# Altium schematic sheet DE-180417_01.SchDoc: Power Board
size A4; Author: eldar6776@hotmail.com; DrawnBy: Eldar Dedić; Organization: I-MEDIA GROUP d.o.o.; Address1: Topal Osman Paše 18; Address2: 71000 Sarajevo; Address3: Federacija BiH; Address4: Bosna i Hercegovina; DocumentNumber: 1; Revision: 001; SheetNumber: 1; SheetTotal: 3; ProjectName: Prekidač rasvjete balkona
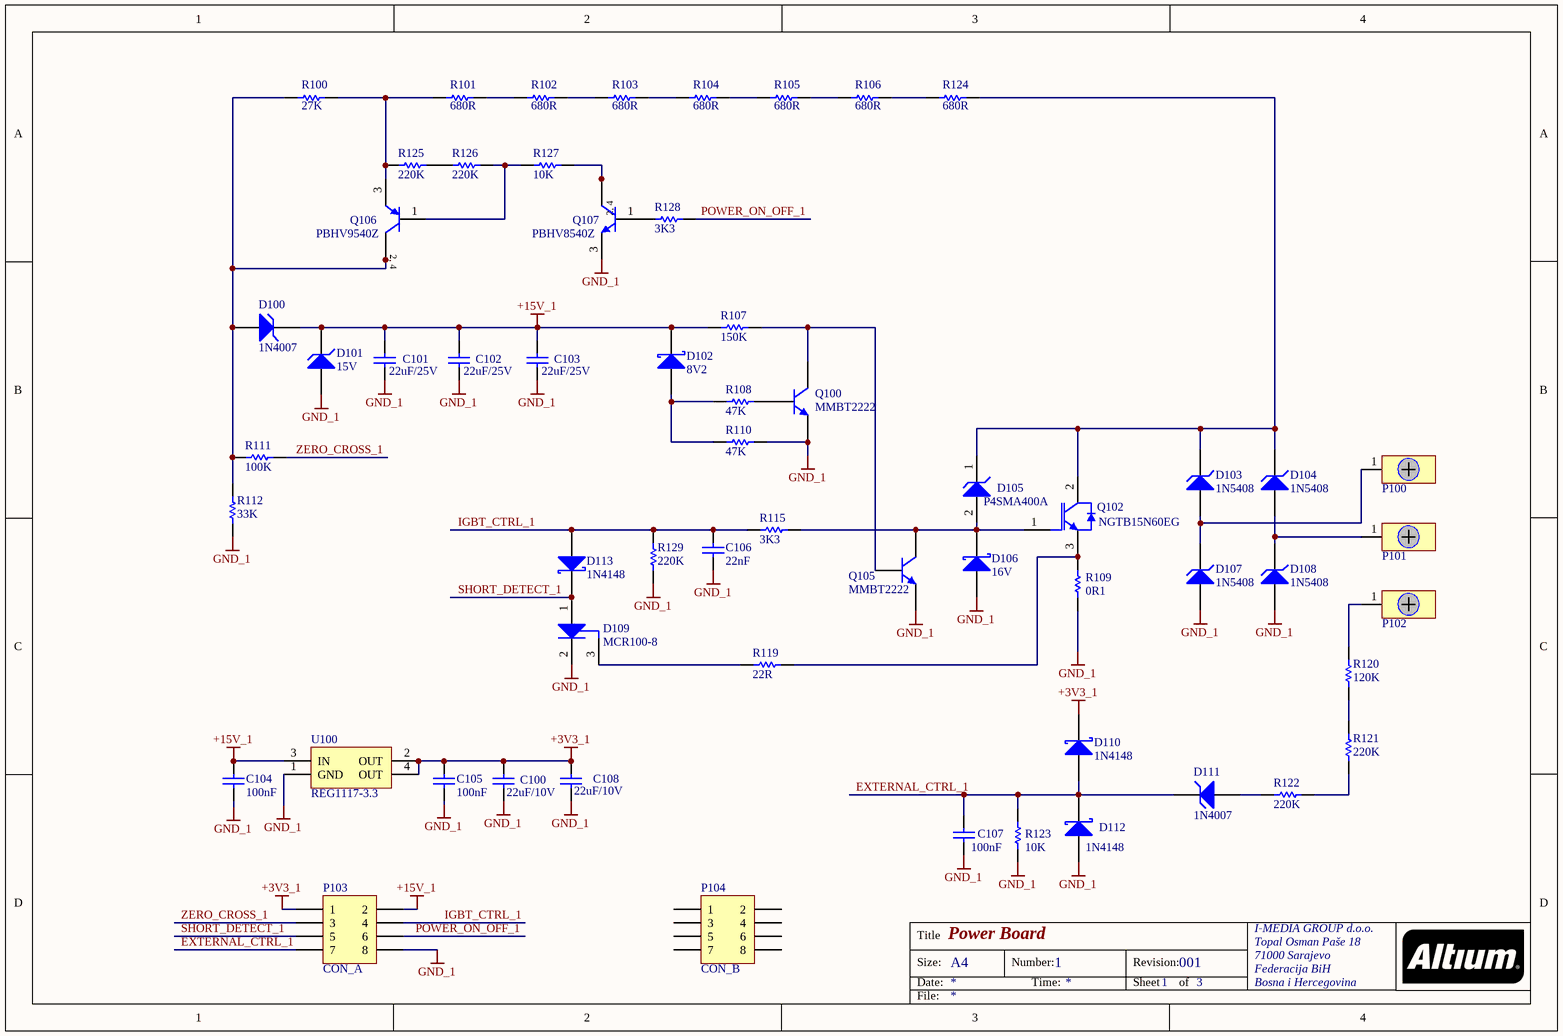
[diagram p0: DE-180417_01.SchDoc]

## Parts
C100  22uF/10V  [1210]
C101  22uF/25V  [1210]
C102  22uF/25V  [1210]
C103  22uF/25V  [1210]
C104  100nF  [0603]
C105  100nF  [0603]
C106  22nF  [0603]
C107  100nF  [0603]
C108  22uF/10V  [1210]
D100  1N4007  [DO214]
D101  15V  [DO214]
D102  8V2  [SOD323]
D103  1N5408  [DO214]
D104  1N5408  [DO214]
D105  P4SMA400A  [ONSC-SMC-2-403-03_V]
D106  16V  [SOD323]
D107  1N5408  [DO214]
D108  1N5408  [DO214]
D109  MCR100-8  [INF-SOT89_N]
D110  1N4148  [SOD323]
D111  1N4007  [DO214]
D112  1N4148  [SOD323]
D113  1N4148  [SOD323]
P100  Single Wire Lug  [Single Wire Lug]  (value not drawn)
P101  Single Wire Lug  [Single Wire Lug]  (value not drawn)
P102  Single Wire Lug  [Single Wire Lug]  (value not drawn)
P103  CON_A  [HDR2X4]
P104  CON_B  [HDR2X4]
Q100  MMBT2222  [SOT23_N]
Q102  NGTB15N60EG  [ONSC-TO-220-3-221A-09]
Q105  MMBT2222  [SOT23_N]
Q106  PBHV9540Z  [SOT223_N]
Q107  PBHV8540Z  [SOT223_N]
R100  27K  [12-1812]
R101  680R  [12-1812]
R102  680R  [12-1812]
R103  680R  [12-1812]
R104  680R  [12-1812]
R105  680R  [12-1812]
R106  680R  [12-1812]
R107  150K  [ERA-0603]
R108  47K  [ERA-0603]
R109  0R1  [14-1210]
R110  47K  [ERA-0603]
R111  100K  [ERA-0603]
R112  33K  [ERA-0805]
R115  3K3  [ERA-0603]
R119  22R  [ERA-0603]
R120  120K  [ERA-0805]
R121  220K  [ERA-0805]
R122  220K  [ERA-0805]
R123  10K  [ERA-0603]
R124  680R  [12-1812]
R125  220K  [ERA-0805]
R126  220K  [ERA-0805]
R127  10K  [ERA-0805]
R128  3K3  [ERA-0805]
R129  220K  [ERA-0603]
U100  REG1117-3.3  [ZZ311]

## Nets
+3V3_1: C100.2 C105.2 C108.2 D110.1(K) P103.1 U100.2(OUT) U100.4(OUT)
+15V_1: C101.2 C102.2 C103.2 C104.2 D100.2(K) D101.2(K) D102.1(K) P103.2 R107.1 U100.3(IN)
GND_1: C100.1 C101.1 C102.1 C103.1 C104.1 C105.1 C106.1 C107.1 C108.1 D101.1(A) D106.2(A) D107.1(A) D108.1(A) D109.2(K) D112.2(A) P103.8 Q100.2(E) Q105.2(E) Q107.3(E) R109.1 R110.2 R112.1 R123.1 R129.1 U100.1(GND)
EXTERNAL_CTRL_1: C107.2 D110.2(A) D111.2(K) D112.1(K) P103.7 R123.2
IGBT_CTRL_1: C106.2 D113.2(A) P103.4 R115.1 R129.2
POWER_ON_OFF_1: P103.6 R128.1
SHORT_DETECT_1: D109.1(A) D113.1(K) P103.5
ZERO_CROSS_1: P103.3 R111.1
NetD100_1: D100.1(A) Q106.2(C) Q106.4(C) R100.1 R111.2 R112.2
NetD102_2: D102.2(A) R108.1 R110.1
NetD103_1: D103.1(A) D107.2(K) P100.1
NetD103_2: D103.2(K) D104.2(K) D105.1(K) Q102.2(C) R124.2
NetD104_1: D104.1(A) D108.2(K) P101.1
NetD105_2: D105.2(A) D106.1(K) Q102.1(G) Q105.3(C) R115.2
NetD109_3: D109.3(G) R119.1
NetD111_1: D111.1(A) R122.2
NetP102_1: P102.1 R120.1
NetQ100_1: Q100.1(B) R108.2
NetQ100_3: Q100.3(C) Q105.1(B) R107.2
NetQ102_3: Q102.3(E) R109.2 R119.2
NetQ106_1: Q106.1(B) R126.1 R127.2
NetQ106_3: Q106.3(E) R100.2 R101.1 R125.1
NetQ107_1: Q107.1(B) R128.2
NetQ107_2: Q107.2(C) Q107.4(C) R127.1
NetR101_2: R101.2 R102.1
NetR102_2: R102.2 R103.1
NetR103_2: R103.2 R104.1
NetR104_2: R104.2 R105.1
NetR105_2: R105.2 R106.1
NetR106_2: R106.2 R124.1
NetR120_2: R120.2 R121.1
NetR121_2: R121.2 R122.1
NetR125_2: R125.2 R126.2

Not connected (* = marked no-connect by the designer): P104 1 2 3 4 5 6 7 8

## Notes on the sheet
- Title
- Size:
- Date:
- A4
- Number:
- Time:
- Revision:
- Sheet
- of
- File:
- (in symbol BCP51) 2, 4
- (in symbol BCP54) 2, 4

## Library data of the parts
C100-C103 C108 = C1210: Ceramic Chip Capacitor - Standard; Published: 17-Jul-2002; LatestRevisionDate: 19-Mar-2004; LatestRevisionNote: Silkscreen size reduced.; DatasheetDocument: Mar-2001; PackageDocument: Mar-2001; PackageReference: 1210; Publisher: Altium Limited; Code_JEITA: 1210; Code_IPC: 3225 [1210]; ComponentLink1Description: Manufacturer Link; ComponentLink1URL: http://www.kemet.com/; ComponentLink2Description: Datasheet; ComponentLink2URL: http://www.kemet.com/kemet/web/homepage/kechome.nsf/vapubfilesname/F3102TA.pdf/$file/F3102TA.pdf
  C100 C108: Value: 22uF/10V
  C101-C103: Value: 22uF/25V
C104-C107 = C0603: Ceramic Chip Capacitor - Standard; Note: Footprint corresponds to dimensions for bulk cassette packaging. This case size has tightened tolerances.; Published: 17-Jul-2002; LatestRevisionDate: 19-Mar-2004; LatestRevisionNote: Silkscreen size reduced.; DatasheetDocument: Mar-2001; PackageDocument: Mar-2001; PackageReference: 0603; Publisher: Altium Limited; Code_JEITA: 0603; Code_IPC: 1608 [0603]; ComponentLink1Description: Manufacturer Link; ComponentLink1URL: http://www.kemet.com/; ComponentLink2Description: Datasheet; ComponentLink2URL: http://www.kemet.com/kemet/web/homepage/kechome.nsf/vapubfilesname/F3102TA.pdf/$file/F3102TA.pdf
D100 D111 = BZG03C10: Silicon Zener Diode (3W); Published: 8-Jun-2000; LatestRevisionDate: 17-Jul-2002; LatestRevisionNote: Re-released for DXP Platform.; DatasheetDocument: 1-Apr-1999; PackageDocument: Apr-1999; PackageReference: DO214; Publisher: Altium Limited; ComponentLink1Description: Manufacturer Link; ComponentLink1URL: http://www.vishay.com/; ComponentLink2Description: Datasheet; ComponentLink2URL: http://www.vishay.com/docs/85593/85593.pdf
D101 D103 D104 D107 D108 = BZG05C15: Silicon Zener Diode (3W); Published: 8-Jun-2000; LatestRevisionDate: 17-Jul-2002; LatestRevisionNote: Re-released for DXP Platform.; DatasheetDocument: 1-Apr-1999; PackageDocument: Apr-1999; PackageReference: DO214; Publisher: Altium Limited; ComponentLink1Description: Manufacturer Link; ComponentLink1URL: http://www.vishay.com/; ComponentLink2Description: Datasheet; ComponentLink2URL: http://www.vishay.com/docs/85595/85595.pdf
  D101: Value: 15V
  D103 D104 D107 D108: Value: 1N5408
D102 D106 D110 D112 D113 = 1PS76SB10: Schottky Barrier Diode; Published: 17-Sep-2003; LatestRevisionDate: 19-Mar-2004; LatestRevisionNote: Silkscreen size reduced.; DatasheetVersion: 14-Oct-1996; PackageVersion: May-1999; PackageReference: SOD323; Publisher: Altium Limited; PackageDescription: SOD-323/SC-76; 2 Leads; Body 1.7 x 1.3 mm, (LxW); ComponentLink1Description: Manufacturer Link; ComponentLink1URL: http://www.semiconductors.philips.com/; ComponentLink2Description: Datasheet; ComponentLink2URL: http://www.semiconductors.philips.com/acrobat/datasheets/1PS76SB10_2.pdf
D105 = 1SMC9.0AT3G: 1500 W Peak Power Zener Transient Voltage Suppressor, Unidirectional, 2-Pin SMC, Pb-Free, Tape and Reel; Manufacturer: On Semiconductor; IR Max (uA): 10; PPK Max (W): 1500; V(BR) Typ (V): 10.55; DatasheetVersion: Rev. 8; PackageVersion: Rev. E, 08/2005; PackageReference: SMC-2-403-03; PackageDescription: 2-Pin Small Molded Package, J-Bend Lead, Body 5.845 x 6.855 mm; Supplier 1: Digi-Key; Supplier Part Number 1: 1SMC9.0AT3G-ND; Supplier 2: Mouser; Supplier Part Number 2: 863-1SMC9.0AT3G; Direction: Unidirectional; Packing: Tape and Reel; RoHS: Pb-Free; Mounting Technology: Surface Mount; PartNumber: 1SMC9.0AT3G; ComponentLink1Description: Manufacturer URL; ComponentLink1URL: http://www.onsemi.com/; ComponentLink2Description: Datasheet; ComponentLink2URL: http://www.onsemi.com/pub_link/Collateral/1SMC5.0AT3-D.PDF; ComponentLink3Description: Package Specification; ComponentLink3URL: http://www.onsemi.com/pub_link/Collateral/403-03.PDF
D109 = BAW78D: Silicon Switching Diode, SOT89, Reel, Green; Manufacturer: Infineon; Green: TRUE; PackageReference: SOT89; PackageDescription: 3-Pin Small Outline Transistor Package, 2.5 x 4.5 mm Body; Supplier 1: Mouser; Supplier Part Number 1: N/A; Packing: Reel; Mounting Technology: Surface Mount; PartNumber: BAW78D; ComponentLink1Description: Manufacturer URL; ComponentLink1URL: http://www.infineon.com/; ComponentLink2Description: Datasheet; ComponentLink2URL: http://www.infineon.com/dgdl/baw78_baw79series.pdf?folderId=db3a30431400ef6801141c4ed9df0449&fileId=db3a30431400ef6801141c5037ac044a; ComponentLink3Description: Package Specification; ComponentLink3URL: http://www.infineon.com/dgdl/SOT89-Package_Overview.pdf?folderId=db3a30431936bc4b01195371b8363cff&fileId=db3a30431936bc4b0119537ed61d3d22
P100-P102 = Wire Lug
P103 P104 = Header 4X2: Header, 4-Pin, Dual row; LatestRevisionDate: 17-Jul-2002; LatestRevisionNote: Re-released for DXP Platform.; Publisher: Altium Limited
Q100 Q105 = BC817: NPN General-purpose Transistor; Published: 17-Sep-2003; LatestRevisionDate: 12-Dec-2006; LatestRevisionNote: IPC-7351 Footprint Added.; DatasheetVersion: Jun-1999; PackageVersion: May-1999; PackageReference: SOT23; Publisher: Altium Limited; PackageDescription: 3-Pin SOT-23 Package 0.95 mm Pitch, 2.3 mm Lead Span; ComponentLink1Description: Manufacturer Link; ComponentLink1URL: http://www.semiconductors.philips.com/; ComponentLink2Description: Datasheet; ComponentLink2URL: http://www.semiconductors.philips.com/acrobat/datasheets/BC817_BC817W_BC337_5.pdf
Q102 = NGTB15N60EG: IGBT - Short-Circuit Rated, 3-Pin TO-220, Pb-Free, Tube; Manufacturer: On Semiconductor; DatasheetVersion: Rev. 7; PackageVersion: Rev. AG, 09/2011; PackageReference: TO-220-3-221A-09; PackageDescription: 3-Pin Flange Mount, Vertical Straight Lead, Body 9.97 x 4.445 mm, Pitch 2.54 mm; Supplier 1: Digi-Key; Supplier Part Number 1: NGTB15N60EGOS-ND; Supplier 2: Farnell; Supplier Part Number 2: 2216666; Supplier 3: Newark; Supplier Part Number 3: 07W7304; Supplier 4: Newark; Supplier Part Number 4: 46W5231; Supplier 5: Mouser; Supplier Part Number 5: 863-NGTB15N60EG; Packing: Tube; RoHS: Pb-Free; Mounting Technology: Through Hole; PartNumber: NGTB15N60EG; ComponentLink1Description: Manufacturer URL; ComponentLink1URL: http://www.onsemi.com/; ComponentLink2Description: Datasheet; ComponentLink2URL: http://www.onsemi.com/pub_link/Collateral/NGTB15N60E-D.PDF; ComponentLink3Description: Package Specification; ComponentLink3URL: http://www.onsemi.com/pub_link/Collateral/221A-09.PDF
Q106 = BCP51: PNP Medium Power Transistor; Published: 17-Sep-2003; LatestRevisionDate: 12-Dec-2006; LatestRevisionNote: IPC-7351 Footprint Added.; DatasheetVersion: 10-Oct-2001; PackageVersion: Aug-2001; PackageReference: SOT223; Publisher: Altium Limited; PackageDescription: 4-Pin SOT-223 Package 2.3 mm Pitch, 7 mm Lead Span; ComponentLink1Description: Manufacturer Link; ComponentLink1URL: http://www.semiconductors.philips.com/; ComponentLink2Description: Datasheet; ComponentLink2URL: http://www.semiconductors.philips.com/acrobat/datasheets/BCP51_52_53_5.pdf
Q107 = BCP54: NPN Medium Power Transistor; Published: 17-Sep-2003; LatestRevisionDate: 12-Dec-2006; LatestRevisionNote: IPC-7351 Footprint Added.; DatasheetVersion: 10-Oct-2001; PackageVersion: Aug-2001; PackageReference: SOT223; Publisher: Altium Limited; PackageDescription: 4-Pin SOT-223 Package 2.3 mm Pitch, 7 mm Lead Span; ComponentLink1Description: Manufacturer Link; ComponentLink1URL: http://www.semiconductors.philips.com/; ComponentLink2Description: Datasheet; ComponentLink2URL: http://www.semiconductors.philips.com/acrobat/datasheets/BC635_BCP54_BCX54_6.pdf
R100-R106 R124 = ERJ12: Thick Film Chip Resistor, 1 Ohm to 10M Ohm Range, 5% Tolerance, 1812 Size, 0.5 W; Note: If flow soldering, adjust pad width of PCB Footprint to 0.7 - 0.8 times the width of the resistor.; Published: 17-Dec-2003; LatestRevisionDate: 19-Mar-2004; LatestRevisionNote: Silkscreen size reduced.; PackageDocument: Mar-2003; PackageReference: 12-1812; Publisher: Altium Limited; ComponentLink1Description: Manufacturer Link; ComponentLink1URL: http://www.panasonic.com/industrial/components/resistive_products.htm; ComponentLink2Description: Datasheet; ComponentLink2URL: http://www.panasonic.com/industrial/components/pdf/AOA0000CE1.pdf
  R100: Value: 27K
  R101-R106 R124: Value: 680R
R107 R108 R110 R111 R115 R119 R123 R129 = ERAV: Metal Film Thermosensitive Chip Resistor, 0.56 Ohm to 10k Ohm Range, 5% Tolerance, 0603 Size, 0.063 W; Note: If flow soldering, adjust pad width of PCB Footprint to 0.7 - 0.8 times the width of the resistor.; Published: 17-Dec-2003; LatestRevisionDate: 19-Mar-2004; LatestRevisionNote: Silkscreen size reduced.; PackageDocument: Mar-2003; PackageReference: ERA-0603; Publisher: Altium Limited; Code_IPC: 1608 [0603]; ComponentLink1Description: Manufacturer Link; ComponentLink1URL: http://www.panasonic.com/industrial/components/resistive_products.htm; ComponentLink2Description: Datasheet; ComponentLink2URL: http://www.panasonic.com/industrial/components/pdf/AOF0000CE1.pdf
R109 = ERJ14: Thick Film Chip Resistor, 1 Ohm to 10M Ohm Range, 5% Tolerance, 1210 Size, 0.25 W; Note: If flow soldering, adjust pad width of PCB Footprint to 0.7 - 0.8 times the width of the resistor.; Published: 17-Dec-2003; LatestRevisionDate: 19-Mar-2004; LatestRevisionNote: Silkscreen size reduced.; PackageDocument: Mar-2003; PackageReference: 14-1210; Publisher: Altium Limited; Code_IPC: 3225 [1210]; ComponentLink1Description: Manufacturer Link; ComponentLink1URL: http://www.panasonic.com/industrial/components/resistive_products.htm; ComponentLink2Description: Datasheet; ComponentLink2URL: http://www.panasonic.com/industrial/components/pdf/AOA0000CE1.pdf; Value: 0R1
R112 R120-R122 R125-R128 = ERA6Y: Rectangular Thick Film Chip Resistor, 10 Ohm to 1M Ohm Range, 0.1% and 0.5% Tolerance, 0805 Size, 0.1 W; Note: If flow soldering, adjust pad width of PCB Footprint to 0.7 - 0.8 times the width of the resistor.; Published: 17-Dec-2003; LatestRevisionDate: 19-Mar-2004; LatestRevisionNote: Silkscreen size reduced.; PackageDocument: Mar-2003; PackageReference: ERA-0805; Publisher: Altium Limited; Code_IPC: 2012 [0805]; ComponentLink1Description: Manufacturer Link; ComponentLink1URL: http://www.panasonic.com/industrial/components/resistive_products.htm; ComponentLink2Description: Datasheet; ComponentLink2URL: http://www.panasonic.com/industrial/components/pdf/AOA0000CE8.pdf
  R112: Value: 33K
  R120: Value: 120K
  R121 R122: Value: 220K
U100 = REG1117-3.3: 800mA and 1A Low Dropout Positive Regulator 2.85V, 3.3V, 5V, and Adjustable; Published: 8-Jun-2000; LatestRevisionDate: 17-Jul-2002; LatestRevisionNote: Re-released for DXP Platform.; DatasheetVersion: Sep-1997; PackageVersion: revC; PackageReference: ZZ311; Publisher: Altium Limited; PackageDescription: SOT-223/SC-73; 4 Leads; Body 6.7 x 7.3 mm, inc. leads (LxW max); ComponentLink1Description: Manufacturer Link; ComponentLink1URL: http://www.ti.com/; ComponentLink2Description: Datasheet; ComponentLink2URL: http://www-s.ti.com/sc/ds/REG1117.pdf